# EAGLE design TimingTesterV1 (EAGLE 7.3.0)
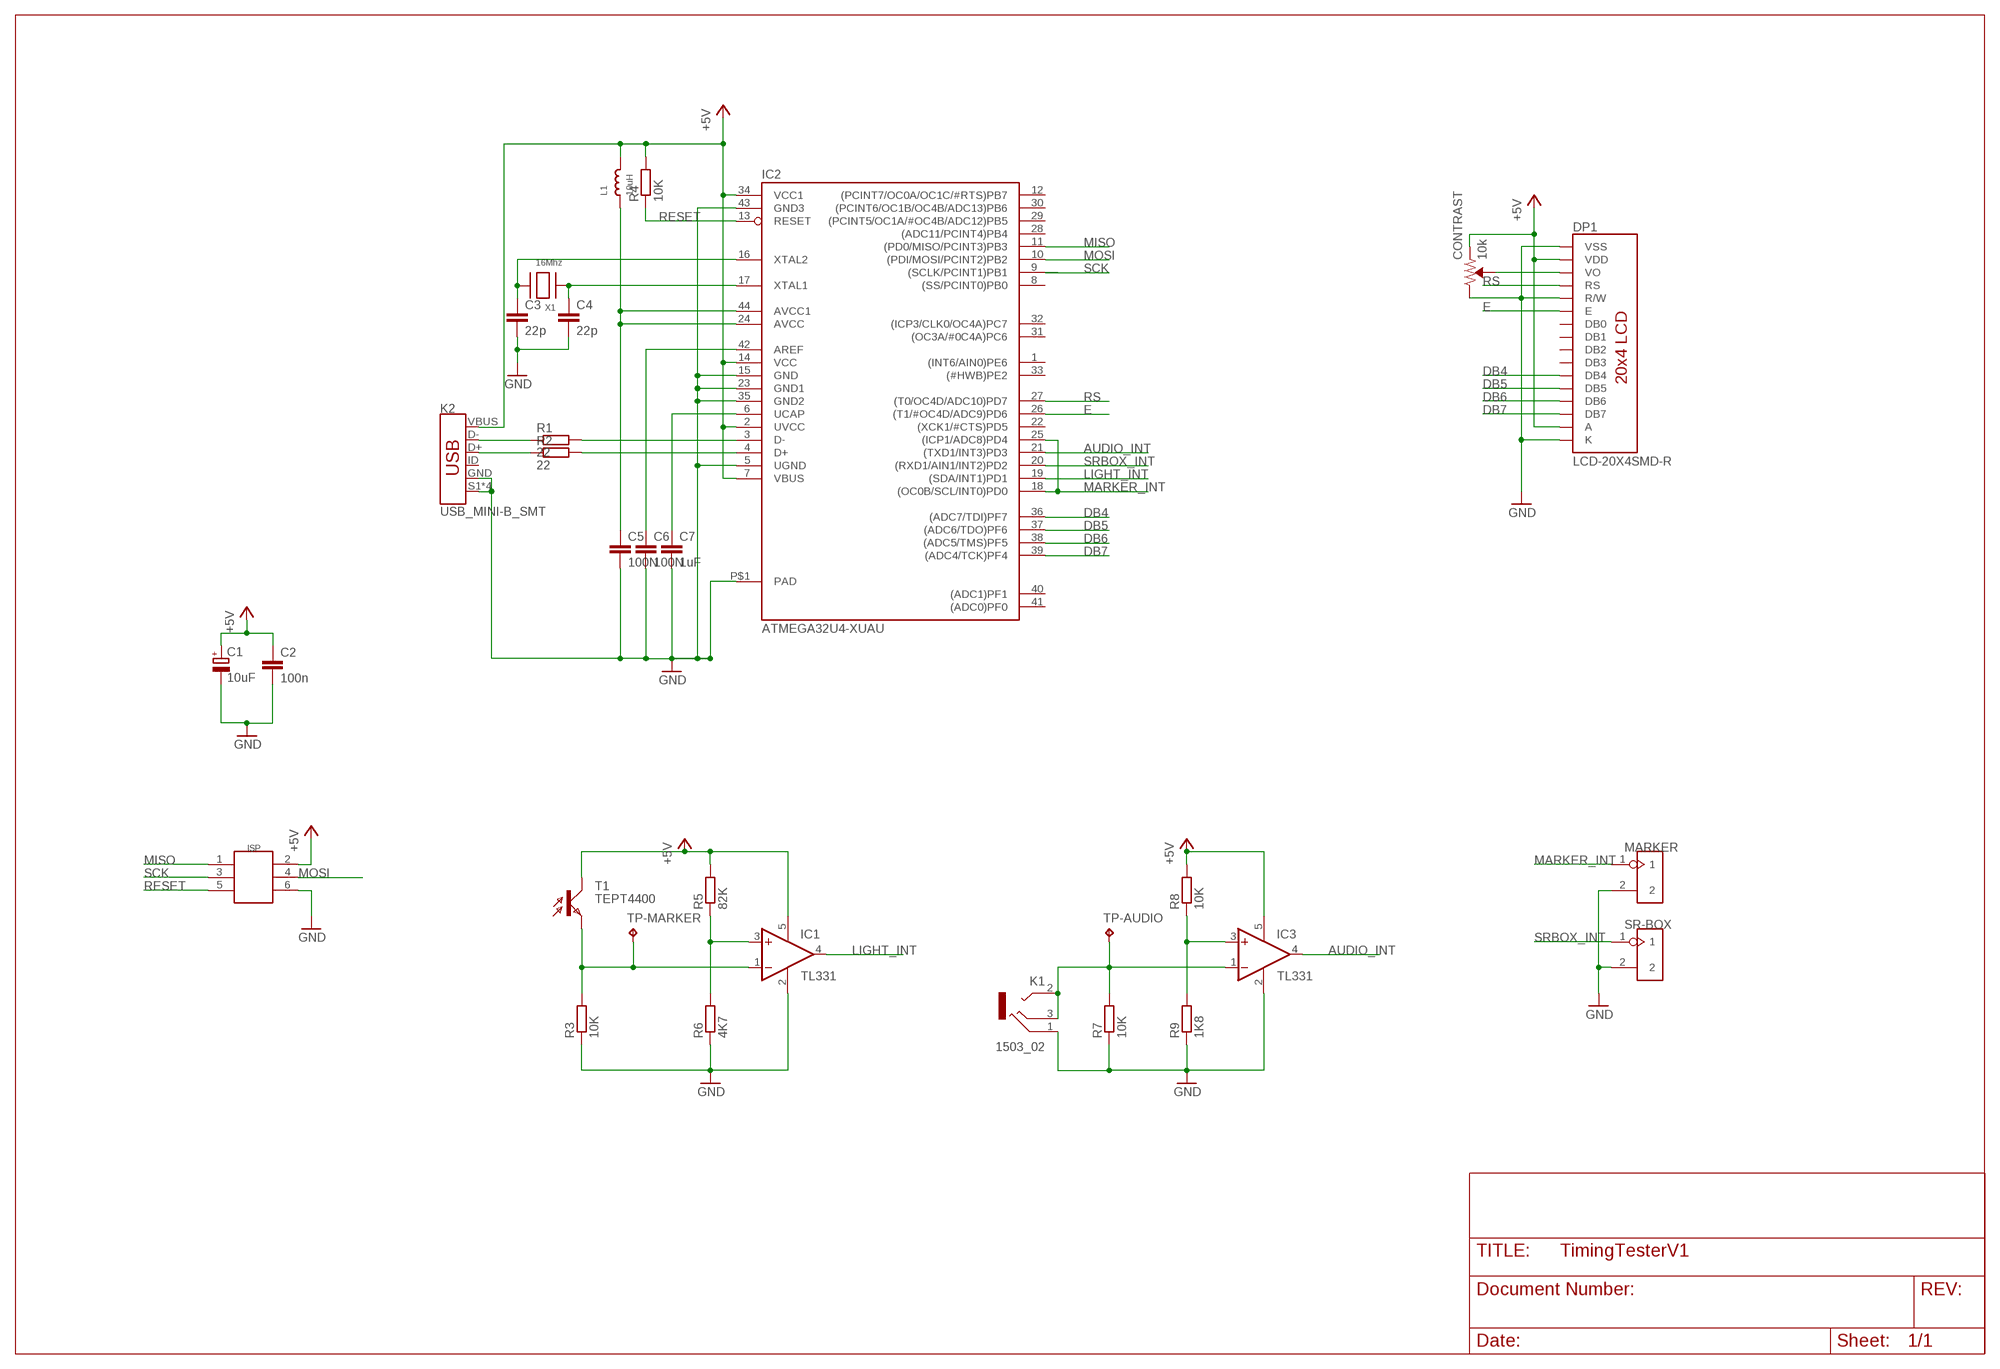
[diagram p0: schematic, sheet 1]

## Parts
C1  10uF  CPOL-EUR/2012-12R  [R/2012-12R]
C2  100n  C-EUC0805  [C0805]
C3  22p  C-EUC0805  [C0805]
C4  22p  C-EUC0805  [C0805]
C5  100N  C-EUC0805  [C0805]
C6  100N  C-EUC0805  [C0805]
C7  1uF  C-EUC0805  [C0805]
CONTRAST  10k  TRIMPOT-SMD-3MM-OPEN-1/10W-25%  [TRIMPOT-SMD-TC33X]
DP1  LCD-20X4SMD-R  [LCD-20X4-SMD]
IC1  TL331  [DBV-R-PDSO-G5]
IC2  ATMEGA32U4-XUAU  [TQFP44-PAD]
IC3  TL331  [DBV-R-PDSO-G5]
ISP  HEADER-2X3P-SMD  [2X3P-2.54-SMD]
K1  1503_02  [1503_02]
K2  USB_MINI-B_SMT  [USB-MINIB]
L1  10uH  INDUCTOR0805  [0805]
MARKER  HEADER-2PSMD  [2P-2.54-SMD]
R1  22  R-EU_M0805  [M0805]
R2  22  R-EU_M0805  [M0805]
R3  10K  R-EU_R0603  [R0603]
R4  10K  R-EU_M0805  [M0805]
R5  82K  R-EU_R0603  [R0603]
R6  4K7  R-EU_R0603  [R0603]
R7  10K  R-EU_R0603  [R0603]
R8  10K  R-EU_R0603  [R0603]
R9  1K8  R-EU_R0603  [R0603]
SR-BOX  HEADER-2PSMD  [2P-2.54-SMD]
T1  TEPT4400  BPX81SMD  [BPX81-SMD]
TP-AUDIO  TPTP20R  [TP20R]
TP-MARKER  TPTP20R  [TP20R]
X1  16Mhz  XTALNX5032  [NX5032]

## Nets
+5V [Vcc]: C1.+ C2.2 CONTRAST.3(CCW) DP1.2(VDD) DP1.15(A) IC1.5(V+) IC2.2(UVCC) IC2.7(VBUS) IC2.14(VCC) IC2.34(VCC1) IC3.5(V+) ISP.2 K2.VBUS L1.2 R4.2 R5.2 R8.2 T1.C
AUDIO_INT: IC2.21((TXD1/INT3)PD3) IC3.4(OUT)
DB4: DP1.11(DB4) IC2.36((ADC7/TDI)PF7)
DB5: DP1.12(DB5) IC2.37((ADC6/TDO)PF6)
DB6: DP1.13(DB6) IC2.38((ADC5/TMS)PF5)
DB7: DP1.14(DB7) IC2.39((ADC4/TCK)PF4)
E: DP1.6(E) IC2.26((T1/#OC4D/ADC9)PD6)
GND: C1.- C2.1 C3.2 C4.2 C5.2 C6.2 C7.2 CONTRAST.1(CW) DP1.1(VSS) DP1.5(R/W) DP1.16(K) IC1.2(GND) IC2.5(UGND) IC2.15(GND) IC2.23(GND1) IC2.35(GND2) IC2.43(GND3) IC2.P$1(PAD) IC3.2(GND) ISP.6 K1.1 K2.GND K2.S1(SHIELD) K2.S2(SHIELD) K2.S3(SHIELD) K2.S4(SHIELD) MARKER.2 R3.1 R6.1 R7.1 R9.1 SR-BOX.2
LIGHT_INT: IC1.4(OUT) IC2.19((SDA/INT1)PD1)
MARKER_INT: IC2.18((OC0B/SCL/INT0)PD0) IC2.25((ICP1/ADC8)PD4) MARKER.1
MISO: IC2.11((PD0/MISO/PCINT3)PB3) ISP.1
MOSI: IC2.10((PDI/MOSI/PCINT2)PB2) ISP.4
N$1: K2.D- R1.1
N$2: K2.D+ R2.1
N$3: IC3.1(-IN) K1.2 K1.3 R7.2 TP-AUDIO.TP
N$6: C5.1 IC2.24(AVCC) IC2.44(AVCC1) L1.1
N$9: IC3.3(+IN) R8.1 R9.2
N$11: CONTRAST.2(WIPER) DP1.3(VO)
N$25: IC1.1(-IN) R3.2 T1.E TP-MARKER.TP
N$28: IC1.3(+IN) R5.1 R6.2
N$44: IC2.3(D-) R1.2
N$46: IC2.4(D+) R2.2
N$48: C6.1 IC2.42(AREF)
N$49: C3.1 IC2.16(XTAL2) X1.P$2
N$50: C7.1 IC2.6(UCAP)
N$51: C4.1 IC2.17(XTAL1) X1.P$1
RESET: IC2.13(RESET) ISP.5 R4.1
RS: DP1.4(RS) IC2.27((T0/OC4D/ADC10)PD7)
SCK: IC2.9((SCLK/PCINT1)PB1) ISP.3
SRBOX_INT: IC2.20((RXD1/AIN1/INT2)PD2) SR-BOX.1
Unconnected: DP1.7(DB0) DP1.8(DB1) DP1.9(DB2) DP1.10(DB3) IC2.1((INT6/AIN0)PE6) IC2.8((SS/PCINT0)PB0) IC2.12((PCINT7/OC0A/OC1C/#RTS)PB7) IC2.22((XCK1/#CTS)PD5) IC2.28((ADC11/PCINT4)PB4) IC2.29((PCINT5/OC1A/#OC4B/ADC12)PB5) IC2.30((PCINT6/OC1B/OC4B/ADC13)PB6) IC2.31((OC3A/#0C4A)PC6) IC2.32((ICP3/CLK0/OC4A)PC7) IC2.33((#HWB)PE2) IC2.40((ADC1)PF1) IC2.41((ADC0)PF0) K1.2@2 K2.ID

## Library data of the parts
C1 = rcl:CPOL-EU: POLARIZED CAPACITOR, European symbol
C2 C5-C7 = rcl:C-EU: CAPACITOR, European symbol
C3 C4 = rcl:C-EU: CAPACITOR, European symbol; FARNELL: 1759489
CONTRAST = SparkFun-Resistors:TRIMPOT: Trimming Potentiometer (Trimpot) Three-terminal potentiometers, with an adjustable wiper and two adjustable resistors. A pot can be used to create a configurable voltage divider, or as a variable resistor. "Trimpots" are a subset of potentiometers, usually intended for "set-and-forget" applications. They're often more delicate than standard potentiometers - rated for fewer turns. Variants PTH-KNOB - PTH Trimpot w/ finger-adjustable knob Trimpot 10K with Knob <https://www.sparkfun.com/products/9806> (COM-09806) Datasheet <http://www.sparkfun.com/datasheets/Components/General/TSR-3386.pdf> SMD-3MM-CLOSED-FRAME - SMD 3mm Square Closed-Frame Trimpot Used on e.g. EasyDriver - Stepper Motor Driver <https://www.sparkfun.com/products/12779> Datasheet <http://www.bitechnologies.com/pdfs/22.pdf> (22AR10KTR) SMD-5MM - SMD 5mm Square Closed-Frame Trimpot Used on e.g. IOIO-OTG - V2.2 <https://www.sparkfun.com/products/13613> Datasheet <http://www.vishay.com/docs/51008/ts53.pdf> (TS53YL502MR10) SMD-3MM-1/10W-25% - 3mm Square Open-Frame Trimpot Used on e.g. SparkFun Shapeoko <https://www.sparkfun.com/products/13899> Datasheet <http://www.bourns.com/docs/Product-Datasheets/TC33.pdf> (TC33X-2-103E); FARNELL: 1689863; PROD_ID: RES-12428, RES-08048
DP1 = SparkFun-Displays:LCD-20X4: Farnell: 2675671
IC1 IC3 = linear:TL331: SINGLE DIFFERENTIAL COMPARATOR Source: Data sheet <http://www.ti.com/lit/ds/symlink/tl331-q1.pdf>; FARNELL: 1470409
IC2 = SmartPrj:ATMEGA32U4-XU; RS: 715-3805
ISP = HR911105:HEADER-2X3P; FARNELL: 9689567
K1 = con-lumberg:1503_02: Jack connectors according to JISC 6560, 3.5 mm Klinkeneinbaukupplung nach JISC 6560, 3,5 mm, 3-polig/stereo, abgewinkelte Ausführung, Surface-Mount-Technik (SMT) Source: http://www.lumberg.com/Produkte/PDFs/1503_02.pdf; OC_FARNELL: 1216979; OC_NEWARK: unknown
K2 = SparkFun-Connectors:USB_MINI-B: USB type Mini-B Connector Breaks out 5th pin, and includes shield pins if needed. SparkFun Products: SparkFun FTDI Basic Breakout <https://www.sparkfun.com/products/9716> SparkFun XBee Explorer USB <https://www.sparkfun.com/products/11812> SparkFun Redboard <https://www.sparkfun.com/products/12757>; FARNELL: 1753806; PROD_ID: CONN-08193; SF_ID: PRT-00587
L1 = microbuilder:INDUCTOR: Inductors 0603: 10nH Ceramic Inductor - microwire antenna/RF (Digikey: 712-1434-2-ND) 0805: 560nH Ceramic Inductor - RF (Digikey: 553-1047-1-ND) 270nH Ceramic Inductor - Q = 40@250MHz, +-5%, 1 Ohm DC Resistance (Digikey: 535-10506-2-ND) 1007 (2518 Metric) SMT: 10µH 10% 250mOhm 820mA 1007 Inductor (Digikey: 587-2189-1-ND) 22µH 10% 500mOhm 580mA 1007 Inductor (Digikey: 587-2190-1-ND) 47µH 10% 950mOhm 420mA 1007 Inductor (Digikey: 587-2191-1-ND) 47µH 5% 100mOhm 1A 1008 Inductor (Digikey: 732-1816-1-ND) 5.0x5.0mm (Taiyo Yuden NR5040 Series) 6.8µH 20% 2.3A 64mOhm Inductor (Digikey: 587-2374-2-ND) 5.0x5.0mm (TDK VLC5045 Series) 4.7µH 20% 3.3A 34mOhm Inductor (Digikey: 445-6526-1-ND) 6.8µH 20% 2.7A 46mOhm Inductor (Digikey: 445-6527-1-ND) 6.0x6.0mm (TDK VLC6045 Series) 4.7µH 20% 3.8A 27mOhm Inductor (Digikey: 445-6538-2-ND) 6.8µH 20% 3A 41mOhm Inductor (Digikey: 445-6540-1-ND) 6.2µH 30% 2.2A 45mOhm Inductor (Digikey: SRR5028-6R2YCT-ND) - Not TDK VLC6045 but footprint should match 6.0x6.0mm (TDK SLF6045 Series) 6.8uH 30% 2A 33mOhm Inductor (Digikey: 445-4572-1-ND, Mouser: 810-SLF645T6R8N2R0PF); FARNELL: 2215650
MARKER SR-BOX = HR911105:HEADER-2P
R1-R9 = rcl:R-EU_: RESISTOR, European symbol
T1 = opto-trans-siemens:BPX81: PHOTO TRANSISTOR
TP-AUDIO TP-MARKER = testpad:TP: Test pad
X1 = adafruit:XTAL: Low cost SMT crystals, no capacitors included http://www.ladyada.net/library/eagle; FARNELL: 2467791

## Net classes
0 default: width 0.305 mm, clearance 0.203 mm
1 RowCols: width 0.356 mm, clearance 0.203 mm
2 Vcc: width 0.356 mm, clearance 0.203 mm

## Board
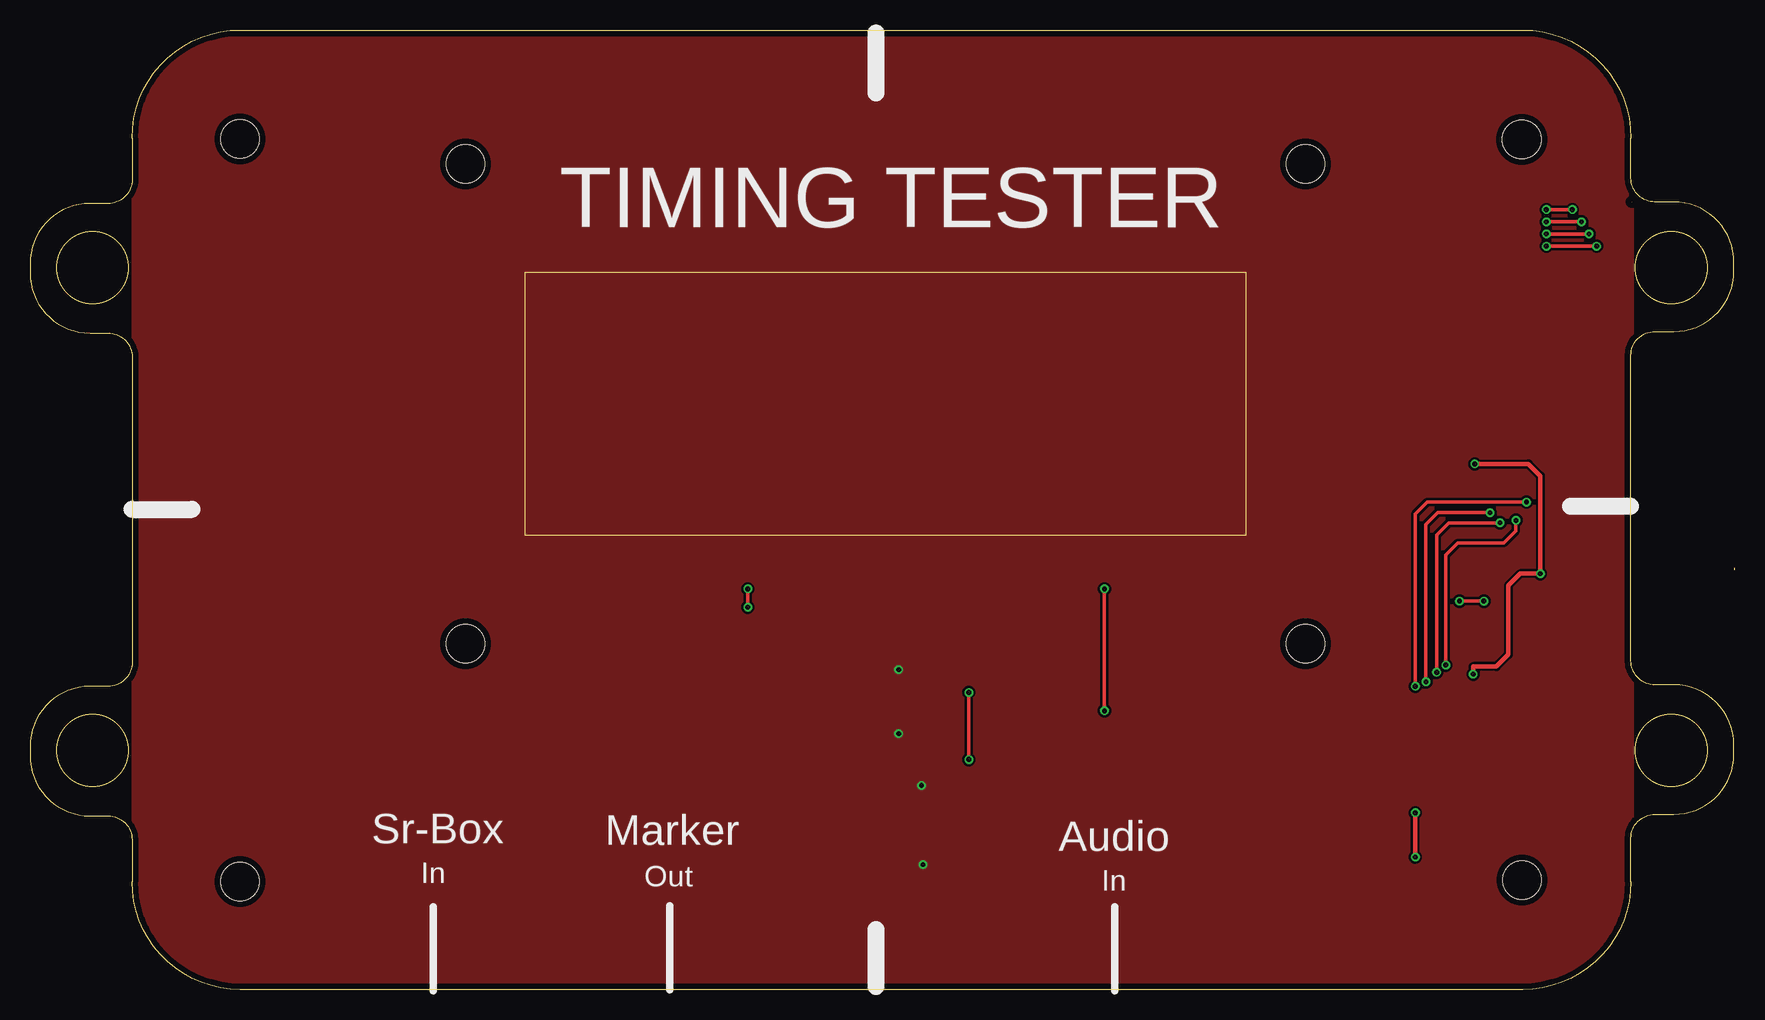
[diagram p1: board, top side]
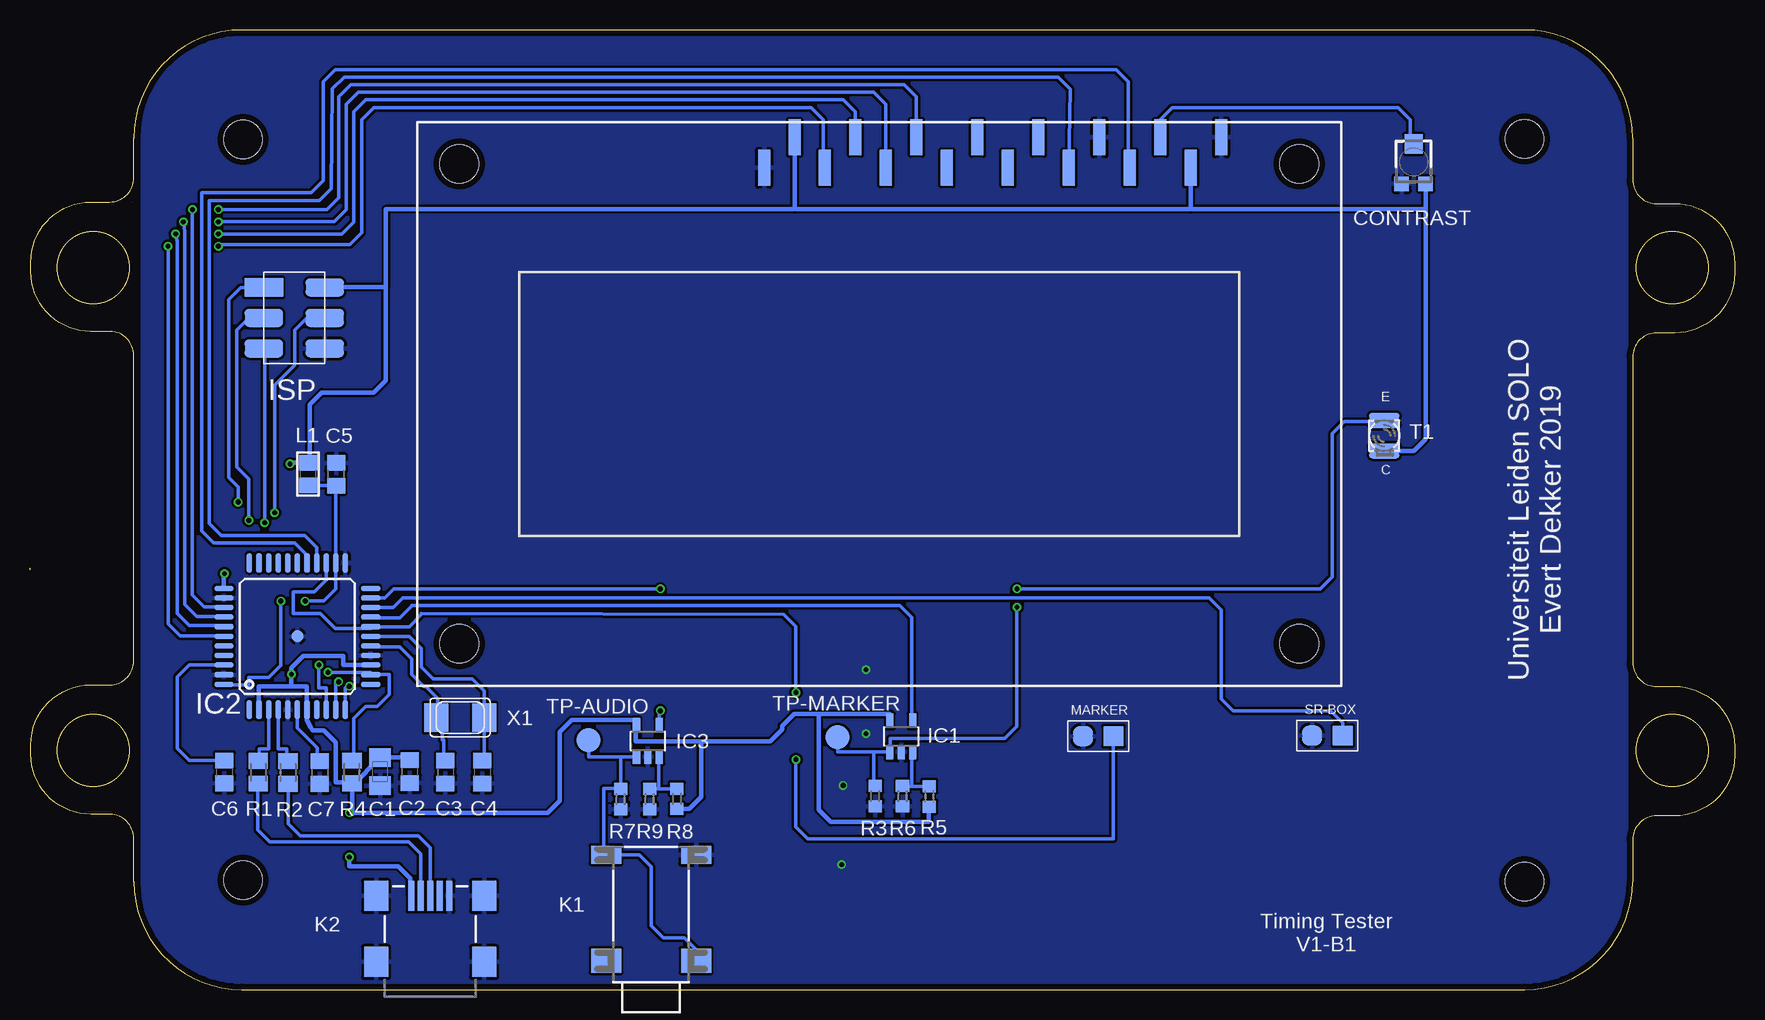
[diagram p2: board, bottom side, seen from below]

Size 142.06 x 80 mm. Coordinates in mm from the lower left corner, seen from the top.
Outline: 142.06,35 142.06,35.15
Outline: 133.41,52.86 arc-90 135.41,54.86 136.99,54.86 arc90 141.99,59.86 141.99,60.66 arc90 136.99,65.66
Outline: 136.99,25.4 arc-90 141.99,20.4 141.99,19.61 arc-90 136.99,14.61 135.41,14.6 arc90 133.41,12.6 133.41,9 arc-90 124.41,0 17.51,0 arc-90 8.51,9 8.51,12.48 arc90 6.51,14.48 5,14.48 arc-90 0,19.48 0,20.27 arc-90 5,25.27 6.51,25.27 arc90 8.51,27.27 8.51,52.74 arc90 6.51,54.74 5,54.74 arc-90 0,59.74 0,60.53 arc-90 5,65.53 6.51,65.53 arc90 8.51,67.53 8.51,71 arc-90 17.51,80 124.41,80 arc-90 133.41,71 133.41,67.66 arc90 135.41,65.66 136.99,65.66
Outline: 136.99,25.4 arc0 136.99,25.4
Outline: 136.99,25.4 135.41,25.4 arc-90 133.41,27.4 133.41,52.87
Outline: 133.48,65.66 arc0 133.48,65.66
Copper layers (1*16): Top 0.035mm / dielectric 1.6mm / Bottom 0.035mm
Design rules "Elecrow_2-layer_PCB_eagle_rule": minimum track width 6mil, minimum drill 12mil, track to track 6mil, track to pad 6mil, pad to pad 6mil, via to via 8mil, smd to smd 0mil, copper to edge 20mil, drill to drill 10mil, minimum pad ring 6mil, minimum via ring 6mil, stop-mask expansion 0mil, vias tented up to drill 100mil, thermal gap 10mil
Holes 3.2 mm at 17.51,9 124.32,9.11 124.31,70.89 17.51,70.9
Milling: area 2.2,57.2 to 8.2,63.2; area 2.2,16.9 to 8.2,22.9; area 133.8,57.2 to 139.8,63.2; area 133.8,16.9 to 139.8,22.9; 4 lines

### Footprints (pad centres in the part's own frame; a part is rotated, then mirrored left to right if it is on the bottom)
R/2012-12R = smd 1.55 x 1.8: + 1.175,0; - -1.175,0
C0805 = smd 1.3 x 1.5: 1 -0.95,0; 2 0.95,0
TRIMPOT-SMD-TC33X = smd 1.2 x 1.2: 1 -1,-1.825; 3 1,-1.825 | smd 1.5 x 1.6: 2 0,1.5
LCD-20X4-SMD = smd 1 x 3 bottom: 1 10.001,45.739; 2 12.541,43.199; 3 15.081,45.739; 4 17.621,43.199; 5 20.161,45.739; 6 22.701,43.199; 7 25.241,45.739; 8 27.781,43.199; 9 30.321,45.739; 10 32.861,43.199; 11 35.401,45.739; 12 37.941,43.199; 13 40.481,45.739; 14 43.021,43.199; 15 45.561,45.739; 16 48.101,43.199 | hole 3.2: 3.5,43.5; 3.5,3.5; 73.5,43.5; 73.5,3.5
DBV-R-PDSO-G5 = smd 0.6 x 1.2: 1 -0.95,-1.306; 2 0,-1.306; 3 0.95,-1.306; 4 0.95,1.306; 5 -0.95,1.306
TQFP44-PAD = smd 1.6 x 0.45: 1 -6.117,4; 2 -6.117,3.2; 3 -6.117,2.4; 4 -6.117,1.6; 5 -6.117,0.8; 6 -6.117,0; 7 -6.117,-0.8; 8 -6.117,-1.6; 9 -6.117,-2.4; 10 -6.117,-3.2; 11 -6.117,-4; 23 6.117,-4; 24 6.117,-3.2; 25 6.117,-2.4; 26 6.117,-1.6; 27 6.117,-0.8; 28 6.117,0; 29 6.117,0.8; 30 6.117,1.6; 31 6.117,2.4; 32 6.117,3.2; 33 6.117,4 | smd 0.45 x 1.6: 12 -4,-6.117; 13 -3.2,-6.117; 14 -2.4,-6.117; 15 -1.6,-6.117; 16 -0.8,-6.117; 17 0,-6.117; 18 0.8,-6.117; 19 1.6,-6.117; 20 2.4,-6.117; 21 3.2,-6.117; 22 4,-6.117; 34 4,6.117; 35 3.2,6.117; 36 2.4,6.117; 37 1.6,6.117; 38 0.8,6.117; 39 0,6.117; 40 -0.8,6.117; 41 -1.6,6.117; 42 -2.4,6.117; 43 -3.2,6.117; 44 -4,6.117 | smd 1 x 1: P$1 0,0
2X3P-2.54-SMD = smd 3.2 x 1.524: 1 -2.54,2.54; 2 2.54,2.54; 3 -2.54,0; 4 2.54,0; 5 -2.54,-2.54; 6 2.54,-2.54
1503_02 = smd 2.5 x 1.5: 1 -3.75,-10.75; 3 3.75,-10.75 | smd 2.5 x 2: 2 -3.75,-1.9; 2@2 3.75,-1.9
USB-MINIB = smd 2.5 x 0.5: D+ 2.5,0; D- 2.5,0.8; GND 2.5,-1.6; ID 2.5,-0.8; VBUS 2.5,1.6 | smd 2.5 x 2: S1 -3,4.5; S2 2.5,4.5; S3 -3,-4.5; S4 2.5,-4.5
0805 = smd 1.3 x 1.5: 1 -0.95,0; 2 0.95,0
2P-2.54-SMD = smd 1.65 x 1.65: 1 0,0; 2 0,-2.54
M0805 = smd 1.3 x 1.6: 1 -0.95,0; 2 0.95,0
R0603 = smd 1 x 1.1: 1 -0.85,0; 2 0.85,0
BPX81-SMD = smd 1.27 x 2.54: C 2.54,0; E 0,0
TP20R = smd 2 x 2: TP 0,0
NX5032 = smd 2 x 2.4: P$1 2,0; P$2 -2,0

### Placement (x,y rotation side)
C1  112.88,18.16 90 bottom
C2  110.4,18.16 90 bottom
C3  107.43,18.13 270 bottom
C4  104.38,18.12 270 bottom
C5  116.55,42.96 90 bottom
C6  125.87,18.14 270 bottom
C7  117.91,18.1 270 bottom
CONTRAST  26.76,69 0 bottom
DP1  32.79,25.32 0 top
IC1  69.46,21.1 0 bottom
IC2  119.78,29.45 90 bottom
IC3  90.57,20.72 0 bottom
ISP  120.03,55.99 0 bottom
K1  90.31,0.5 180 bottom
K2  108.71,5.3 90 bottom
L1  118.88,42.98 90 bottom
MARKER  51.77,21.12 270 bottom
R1  123.05,18.11 90 bottom
R2  120.56,18.1 90 bottom
R3  71.63,16.13 90 bottom
R4  115.22,18.14 270 bottom
R5  67.12,16.1 270 bottom
R6  69.35,16.12 90 bottom
R7  92.84,15.88 90 bottom
R8  88.16,15.9 270 bottom
R9  90.42,15.88 90 bottom
SR-BOX  32.67,21.17 270 bottom
T1  29.21,47.45 270 bottom
TP-AUDIO  95.51,20.8 0 bottom
TP-MARKER  74.76,21.05 0 bottom
X1  106.22,22.67 0 bottom

### Tracks (layer width: path | path; a pad name or v marks a point on that pad's centre or on a via)
+5V  (via drill 0.4)
  Top 0.356: v115.44,11.05 v115.44,14.73 | v120.4,43.81 124.86,43.81 125.86,42.81 v125.86,34.67 124.19,34.67 123.19,33.67 123.19,27.92 122.19,26.92 120.27,26.92 v120.27,26.29
  Bottom 0.356: K2.VBUS 110.36,7.8 110.36,9.29 111.36,10.29 115.44,10.29 v115.44,11.05 | R4.2 115.22,14.73 v115.44,14.73 98.92,14.73 97.92,15.73 97.92,21.48 96.92,22.48 91.52,22.48 IC3.5 91.57,22.03 91.57,20.7 86.11,20.7 | R4.2 115.02,17.19 114.05,18.16 114.05,18.17 C1.+ 110.62,19.34 C2.2 | R4.2 115.22,17.27 116.59,17.27 116.59,20.59 117.59,21.59 118.46,21.59 118.52,21.66 118.66,21.86 118.98,22.48 IC2.7 119,23.33 119,25.27 120.27,25.27 | 120.27,25.27 122.98,25.27 IC2.2 | 86.11,20.7 80.38,20.7 79.38,21.7 79.38,21.99 78.38,22.99 76.33,22.99 | 70.41,22.35 IC1.5 70.41,22.99 76.33,22.99 | R8.2 87.11,15.05 86.11,16.05 86.11,20.7 | R5.2 67.18,15.25 67.18,13.97 75.33,13.97 76.33,14.97 76.33,22.99 | T1.C 26.76,44.91 25.76,45.91 25.76,65.05 | 25.76,65.05 CONTRAST.3 | 25.76,65.05 45.33,65.05 | 45.33,65.05 DP1.2 | 45.33,65.05 78.35,65.05 | 78.35,65.05 DP1.15 | 78.35,65.05 112.39,65.05 112.39,58.55 | 112.39,58.55 117.49,58.55 ISP.2 | 112.39,58.55 112.39,50.78 113.39,49.78 117.75,49.78 118.75,48.78 118.75,43.93 L1.2 120.4,43.93 v120.4,43.81 | v125.86,34.67 125.9,34.67 IC2.34 | 120.27,25.27 v120.27,26.29 120.27,26.81 119.27,27.81 115.95,27.81 115.95,27.05 IC2.14
AUDIO_INT  (via drill 0.4)
  Top 0.305: v89.53,33.4 v89.53,23.24
  Bottom 0.305: IC2.21 112.51,32.65 111.76,33.4 v89.53,33.4 | v89.53,23.24 89.62,23.24 IC3.4
DB4  (via drill 0.4)
  Top 0.305: v126.36,65.02 v128.52,65.02
  Bottom 0.305: DP1.11 68.2,74.44 69.2,75.44 115.33,75.44 116.33,74.44 116.33,66.02 117.33,65.02 v126.36,65.02 | v128.52,65.02 128.52,32.88 127.52,31.88 125.9,31.88 IC2.36
DB5  (via drill 0.4)
  Top 0.305: v126.36,64.01 v129.29,64.01
  Bottom 0.305: DP1.12 70.74,73.8 71.74,74.8 114.7,74.8 115.7,73.8 115.7,65.01 116.7,64.01 v126.36,64.01 | v129.29,64.01 129.16,63.25 129.16,32.12 128.16,31.11 125.9,31.11 IC2.37
DB6  (via drill 0.4)
  Top 0.305: v126.36,62.99 v129.92,62.99
  Bottom 0.305: DP1.13 73.28,73.17 74.28,74.17 114.06,74.17 115.06,73.17 115.06,63.99 116.06,62.99 v126.36,62.99 | v129.92,62.99 129.79,62.36 129.79,31.35 128.79,30.35 125.9,30.35 IC2.38
DB7  (via drill 0.4)
  Top 0.305: v126.36,61.98 v130.56,61.98
  Bottom 0.305: DP1.14 75.95,68.52 75.95,72.53 76.95,73.53 113.43,73.53 114.43,72.53 114.43,63.1 115.43,62.1 126.11,62.1 v126.36,61.98 | v130.56,61.98 130.56,30.46 129.56,29.46 125.9,29.46 IC2.39
E
  Bottom 0.305: DP1.6 55.39,75.06 56.39,76.07 115.85,76.07 116.85,75.08 116.95,66.77 117.95,65.79 127.13,65.79 127.13,38.85 126.13,37.85 119.18,37.85 118.18,36.85 IC2.26
GND  (via drill 0.4)
  other vias: 72.39,21.34 74.3,17.02 74.42,10.41 72.39,26.67
  pour Bottom: 124.48,0 17.64,0 arc-90 9.05,9.32 9.05,70.95 arc-90 17.64,79.63 124.48,79.63 arc-90 132.66,70.55 132.66,8.92 arc-90
  pour Top: 124.48,0 17.64,0 arc-90 8.64,9 8.64,70.63 arc-90 17.64,79.63 124.48,79.63 arc-90 133.48,70.63 133.48,9 arc-90
LIGHT_INT
  Bottom 0.305: IC1.4 68.58,22.41 68.58,31 69.58,32 110.24,32 110.24,31.99 111.24,30.99 113.66,30.99 IC2.19
MARKER_INT  (via drill 0.4)
  Top 0.305: v78.23,19.18 v78.23,24.77
  Bottom 0.305: v78.23,24.77 78.23,30.27 79.23,31.27 109.47,31.37 109.47,31.27 110.47,30.25 IC2.18 113.66,30.1 116.6,30.1 117.6,31.1 117.87,31.37 120.14,31.37 120.14,33.15 118.38,33.15 117.38,34.15 IC2.25 117.47,35.57 | v78.23,19.18 78.23,13.57 77.23,12.57 51.77,12.57 MARKER.1
MISO  (via drill 0.4)
  Top 0.305: v124.71,40.64 116.44,40.64 115.44,39.64 v115.44,25.27
  Bottom 0.305: ISP.1 124.48,58.53 125.48,57.53 125.48,42.67 124.71,41.91 v124.71,40.64 | v115.44,25.27 115.78,25.15 IC2.11
MOSI  (via drill 0.4)
  Top 0.305: v121.67,39.75 117.33,39.75 116.33,38.75 v116.33,25.65
  Bottom 0.305: ISP.4 119.02,55.99 120.02,54.99 120.02,52.05 121.02,51.05 121.67,50.4 v121.67,39.75 | v116.33,25.65 116.58,25.65 IC2.10
N$1
  Bottom 0.305: R1.1 123.06,17.16 123.06,13.32 122.06,12.32 110.51,12.32 109.51,11.32 K2.D-
N$2
  Bottom 0.305: R2.1 120.52,17.15 120.52,13.83 119.52,12.83 109.71,12.83 108.71,11.83 K2.D+
N$3
  Bottom 0.305: IC3.1 92.84,19.41 | 92.84,19.41 95.51,19.41 TP-AUDIO.TP | 92.84,19.41 R7.2 92.84,16.76 94.23,16.76 94.23,11.25 K1.3 91.3,11.25 90.3,10.25 90.3,5.32 89.3,4.32 87.56,4.32 86.56,3.32 K1.2
N$6  (via drill 0.4)
  Top 0.305: v119.13,32.38 v121.16,32.38
  Bottom 0.305: L1.1 116.55,42.03 C5.1 116.58,42.01 IC2.24 | v121.16,32.38 121.16,27.04 122.16,26.04 123.83,26.04 123.83,25.4 125.9,25.4 IC2.44 | IC2.24 116.59,33.38 117.59,32.38 v119.13,32.38
  Bottom 0.406: IC2.24
N$9
  Bottom 0.305: R8.1 89.66,16.75 | 89.66,16.75 90.42,16.75 R9.2 | IC3.3 89.66,19.41 89.66,16.75
N$11
  Bottom 0.305: CONTRAST.2 27.05,70.5 27.05,72.53 28.05,73.53 46.87,73.53 47.87,72.53 DP1.3
N$25  (via drill 0.4)
  Top 0.305: v59.82,31.88 v59.82,33.4
  Bottom 0.305: R3.2 71.75,16.98 71.75,19.81 70.43,19.81 arc90 IC1.1 | IC1.1 70.41,19.81 70.36,19.81 70.36,20.95 60.82,20.95 59.82,21.95 v59.82,31.88 | IC1.1 74.76,19.79 TP-MARKER.TP | v59.82,33.4 34.53,33.4 33.53,34.4 33.53,46.37 32.53,47.37 29.21,47.37 T1.E
N$28
  Bottom 0.305: R5.1 68.58,16.95 | 68.58,16.95 69.35,16.95 R6.2 | IC1.3 68.58,19.79 68.58,16.95
N$44
  Bottom 0.305: R1.2 122.94,19.06 122.94,20.07 122.18,20.07 IC2.3
N$46
  Bottom 0.305: R2.2 120.65,19.05 120.65,20.07 121.38,20.07 IC2.4
N$48
  Bottom 0.305: C6.1 128.79,19.09 129.79,20.09 129.79,26.05 128.79,27.05 IC2.42
N$49
  Bottom 0.305: IC2.16 113.66,28.57 111.24,28.57 110.24,27.57 110.24,26.27 109.24,25.27 109.08,25.27 108.08,24.27 108.08,22.67 X1.P$2 108.22,22.35 107.7,22.35 107.7,20.83 107.57,20.83 107.57,19.08 C3.1
N$50
  Bottom 0.305: C7.1 118.11,19.05 118.11,20.16 118.78,20.83 119.78,21.83 IC2.6
N$51
  Bottom 0.305: C4.1 104.22,19.07 X1.P$1 104.22,24.91 105.22,25.91 108.47,25.91 109.47,26.91 109.47,28.45 110.47,29.45 IC2.17
RESET  (via drill 0.4)
  Top 0.305: v122.5,38.91 118.22,38.91 117.22,37.91 v117.22,26.44
  Bottom 0.305: ISP.5 122.5,53.45 v122.5,38.91 | v117.22,26.44 113.66,26.44 IC2.13 113.66,26.29 112.14,26.29 112.14,24.62 113.14,23.62 114.06,23.62 115.06,22.62 115.06,19.09 | R4.1 115.06,19.09 | 114.94,19.09 115.06,19.09
RS
  Bottom 0.305: DP1.4 50.55,68.52 50.55,75.71 51.55,76.71 116.6,76.71 117.6,75.71 117.6,67.42 118.6,66.42 127.76,66.42 127.76,38.21 126.76,37.21 119.98,37.21 118.98,36.21 IC2.27
SCK  (via drill 0.4)
  Top 0.305: v123.83,39.12 123.83,38.21 122.83,37.21 118.98,37.21 117.98,36.21 v117.98,27.05
  Bottom 0.305: ISP.3 123.84,55.99 124.84,54.99 124.84,43.55 123.84,42.55 123.83,42.55 v123.83,39.12 | v117.98,27.05 117.98,25.15 117.38,25.15 IC2.9
SRBOX_INT
  Bottom 0.305: IC2.20 111.79,31.85 111,32.64 43.8,32.64 42.8,31.64 42.8,24.24 41.8,23.24 33.67,23.24 32.67,22.24 SR-BOX.1

### Text on the board
bPlace: E | C | Universiteit Leiden SOLO / Evert Dekker 2019 | Timing Tester / V1-B1
tNames: TIMING TESTER | Sr-Box | Marker | Audio | In | Out | In